# EAGLE design %C2%B5AvaNut_R3 (EAGLE 6.2)
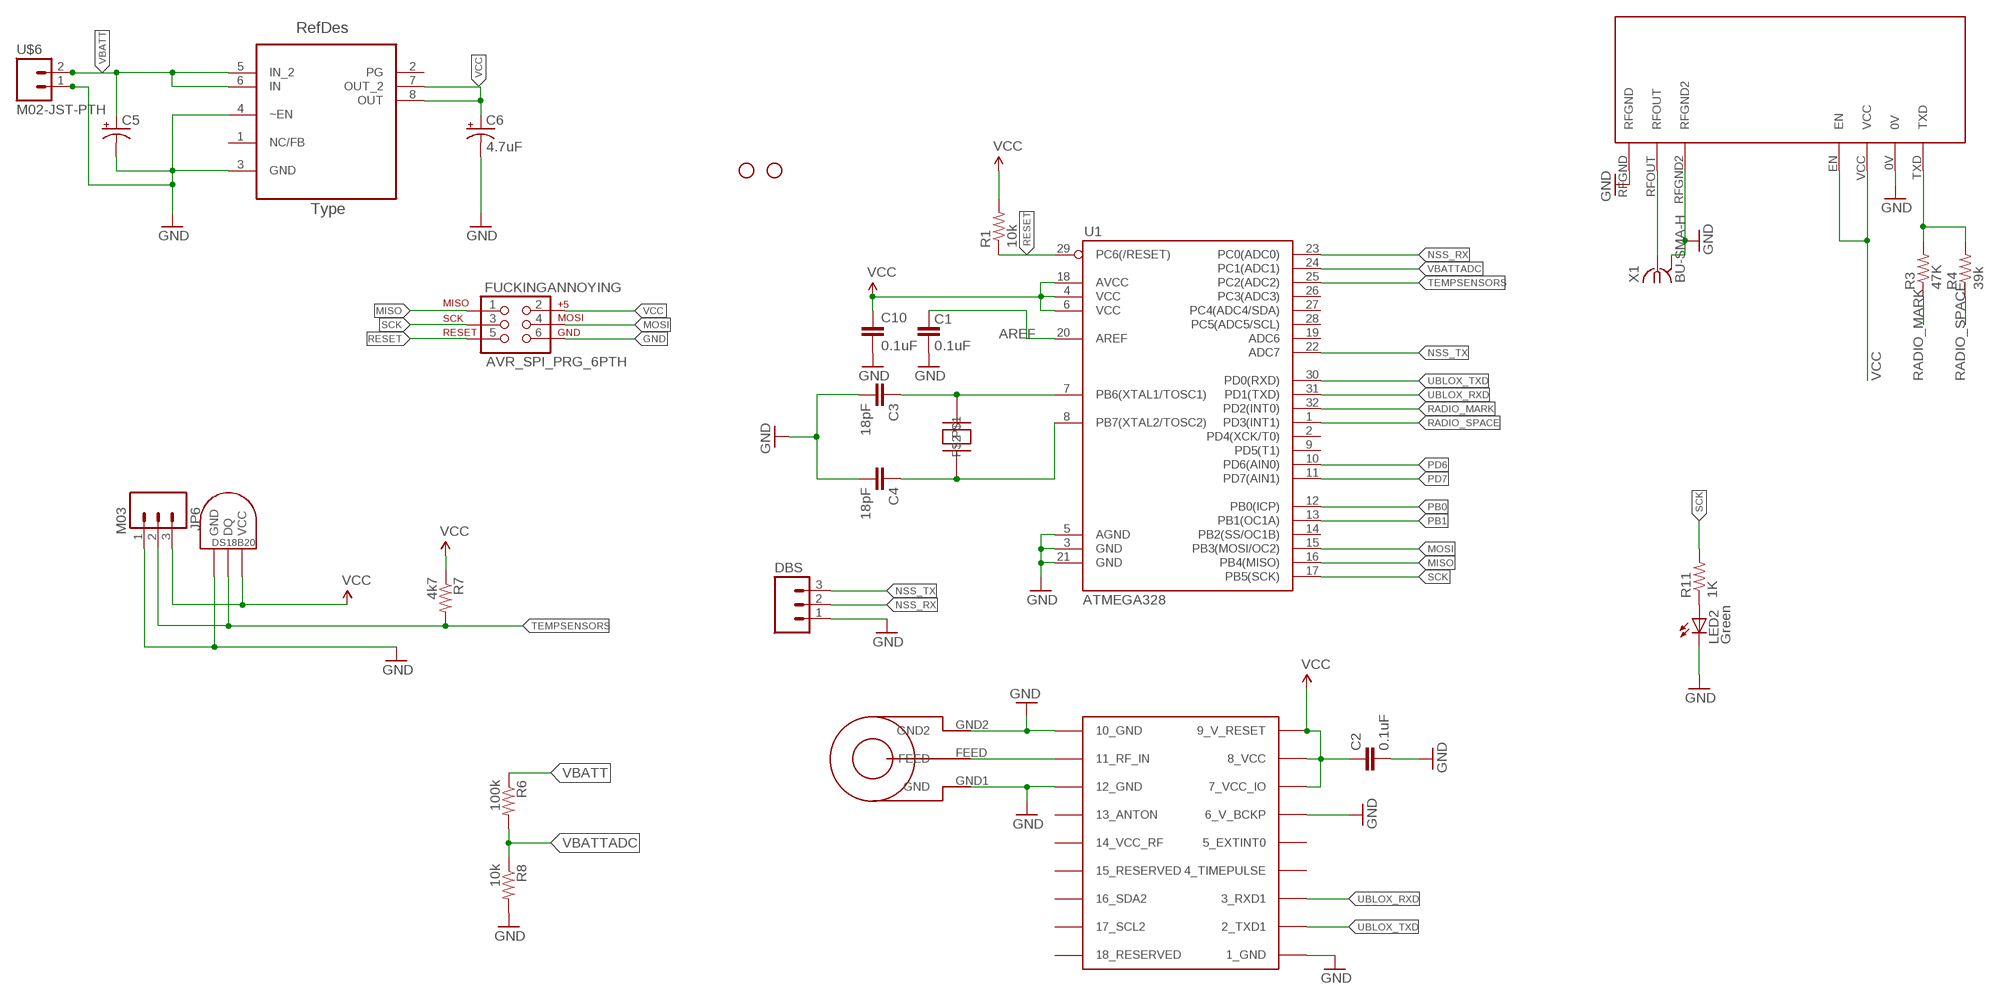
[diagram p0: schematic, sheet 1]

## Parts
C1  0.1uF  CAP0603-CAP  [0603-CAP]
C2  0.1uF  CAP0603-CAP  [0603-CAP]
C3  18pF  CAP0603-CAP  [0603-CAP]
C4  18pF  CAP0603-CAP  [0603-CAP]
C5  CAP_POL1206-KIT  [EIA3216-KIT]
C6  4.7uF  CAP_POL1206-KIT  [EIA3216-KIT]
C10  0.1uF  CAP0603-CAP  [0603-CAP]
DBS  M03PTH  [1X03]
FUCKINGANNOYING  AVR_SPI_PRG_6PTH  [2X3]
JP1  STAND-OFF  [STAND-OFF]
JP2  STAND-OFF  [STAND-OFF]
JP6  M03  [M03-JST]
LED2  Green  LED0603  [LED-0603]
NTX2TEMP  DS1821  DS1820SOIC  [DS18B20_SOIC]
R1  10k  RESISTOR0603-RES  [0603-RES]
R3  47K  RESISTOR0603-RES  [0603-RES]
R4  39k  RESISTOR0603-RES  [0603-RES]
R6  100k  RESISTOR0603-RES  [0603-RES]
R7  4k7  RESISTOR0603-RES  [0603-RES]
R8  10k  RESISTOR0603-RES  [0603-RES]
R11  1K  RESISTOR0603-RES  [0603-RES]
U1  ATMEGA328  ATMEGA168  [TQFP32-08]
U2  TPS76633D  [SOIC127P600X175-8N]
U$1  UBLOX_MAX-6  [UBLOX_MAX-6]
U$2  ABRACON_ABM3_CRYSTAL  [ABRACON_ABM3_CRYSTAL]
U$3  SARANTEL-SR1202  [SARANTEL-SR1202]
U$4  NTX2  [NTX2]
U$6  M02-JST-PTH  [M02-JST-PTH]
X1  BU-SMA-H  [BU-SMA-H]

## Nets
AREF: C1.2 U1.20(AREF)
GND [vcc]: C1.1 C2.2 C3.2 C4.2 C5.C(-) C6.C(-) C10.2 DBS.1 FUCKINGANNOYING.6 JP6.1 LED2.C NTX2TEMP.GND R8.2 U1.3(GND) U1.5(AGND) U1.21(GND) U2.3(GND) U2.4(~EN) U$1.1_GND U$1.6_V_BCKP U$1.10_GND U$1.12_GND U$3.GND1(GND) U$3.GND2 U$4.0V U$4.RFGND U$4.RFGND2 U$6.1 X1.2(GND)
MISO: FUCKINGANNOYING.1 U1.16(PB4(MISO))
MOSI: FUCKINGANNOYING.4 U1.15(PB3(MOSI/OC2))
N$1: U$4.RFOUT X1.1
N$2: R3.2 R4.2 U$4.TXD
N$4: U$1.11_RF_IN U$3.FEED
N$8: LED2.A R11.1
N$9: C3.1 U1.7(PB6(XTAL1/TOSC1)) U$2.P$2
N$10: C4.1 U1.8(PB7(XTAL2/TOSC2)) U$2.P$1
NSS_RX: DBS.2 U1.23(PC0(ADC0))
NSS_TX: DBS.3 U1.22(ADC7)
PB0: U1.12(PB0(ICP))
PB1: U1.13(PB1(OC1A))
PD6: U1.10(PD6(AIN0))
PD7: U1.11(PD7(AIN1))
RADIO_MARK: R3.1 U1.32(PD2(INT0))
RADIO_SPACE: R4.1 U1.1(PD3(INT1))
RESET: FUCKINGANNOYING.5 R1.1 U1.29(PC6(/RESET))
SCK: FUCKINGANNOYING.3 R11.2 U1.17(PB5(SCK))
TEMPSENSORS: JP6.2 NTX2TEMP.DQ R7.2 U1.25(PC2(ADC2))
UBLOX_RXD: U1.31(PD1(TXD)) U$1.3_RXD1
UBLOX_TXD: U1.30(PD0(RXD)) U$1.2_TXD1
VBATT [vcc]: C5.A(+) R6.1 U2.5(IN_2) U2.6(IN) U$6.2
VBATTADC: R6.2 R8.1 U1.24(PC1(ADC1))
VCC: C2.1 C6.A(+) C10.1 FUCKINGANNOYING.2 JP6.3 NTX2TEMP.VCC R1.2 R7.1 U1.4(VCC) U1.6(VCC) U1.18(AVCC) U2.7(OUT_2) U2.8(OUT) U$1.7_VCC_IO U$1.8_VCC U$1.9_V_RESET U$4.EN U$4.VCC
Unconnected: U1.2(PD4(XCK/T0)) U1.9(PD5(T1)) U1.14(PB2(SS/OC1B)) U1.19(ADC6) U1.26(PC3(ADC3)) U1.27(PC4(ADC4/SDA)) U1.28(PC5(ADC5/SCL)) U2.1(NC/FB) U2.2(PG) U$1.4_TIMEPULSE U$1.5_EXTINT0 U$1.13_ANTON U$1.14_VCC_RF U$1.15_RESERVED U$1.16_SDA2 U$1.17_SCL2 U$1.18_RESERVED

## Power pins joined to a net without a drawn wire
GND: X1.3(GND) X1.4(GND) X1.5(GND)

## Library data of the parts
C1-C4 C10 = SparkFun:CAP: Capacitor Standard 0603 ceramic capacitor, and 0.1" leaded capacitor.
C5 C6 = SparkFun:CAP_POL: Capacitor Polarized These are standard SMD and PTH capacitors. Normally 10uF, 47uF, and 100uF in electrolytic and tantalum varieties. Always verify the external diameter of the through hole cap, it varies with capacity, voltage, and manufacturer. The EIA devices should be standard.
DBS = SparkFun:M03: Header 3 Standard 3-pin 0.1" header. Use with straight break away headers (SKU : PRT-00116), right angle break away headers (PRT-00553), swiss pins (PRT-00743), machine pins (PRT-00117), and female headers (PRT-00115). Molex polarized connector foot print use with SKU : PRT-08232 with associated crimp pins and housings.
FUCKINGANNOYING = SparkFun:AVR_SPI_PRG_6: AVR ISP 6 Pin This is the reduced ISP connector for AVR programming. Common on Arduino. This footprint will take up less PCB space and can be used with a 10-pin to 6-pin adapter such as SKU: BOB-08508
JP1 JP2 = SparkFun:STAND-OFF: Stand Off This is the mechanical footprint for a #4 phillips button head screw. Use the keepout ring to avoid running the screw head into surrounding components. SKU : PRT-00447
JP6 = ava:M03
LED2 = SparkFun:LED: LEDs Standard schematic elements and footprints for 5mm, 3mm, 1206, and 0603 sized LEDs. 5mm - Spark Fun Electronics SKU : COM-00529 (and others)
NTX2TEMP = ava:DS1820: DS18B20 Programmable Resolution 1-Wire Digital Thermometer Description The DS18B20 digital thermometer provides 9-bit to 12-bit Celsius temperature measurements and has an alarm function with nonvolatile user-programmable upper and lower trigger points. The DS18B20 communicates over a 1-Wire® bus that by definition requires only one data line (and ground) for communication with a central microprocessor. It has an operating temperature range of -55°C to +125°C and is accurate to ±0.5°C over the range of -10°C to +85°C. In addition, the DS18B20 can derive power directly from the data line ("parasite power"), eliminating the need for an external power supply. Each DS18B20 has a unique 64-bit serial code, which allows multiple DS18B20s to function on the same 1-Wire bus. Thus, it is simple to use one microprocessor to control many DS18B20s distributed over a large area. Applications that can benefit from this feature include HVAC environmental controls, temperature monitoring systems inside buildings, equipment, or machinery, and process monitoring and control systems.
R1 R3 R4 R6-R8 R11 = SparkFun:RESISTOR: Resistor Basic schematic elements and footprints for 0603, 1206, and PTH resistors.
U1 = SparkFun:ATMEGA168
U2 = ava:TPS76633D; DESCRIPTION: ULTRALOW QUIESCENT CURRENT 250-mA LOW DROPOUT VOLTAGE REGULATORS; MPN: TPS76633D; OC_FARNELL: 8461422; OC_NEWARK: 77C1060; PACKAGE: SOIC-8; SUPPLIER: Texas Instruments
U$1 = ava:UBLOX_MAX-6: UBLOX MAX-6
U$2 = ava:ABRACON_ABM3_CRYSTAL
U$3 = ava:SARANTEL-SR1202: SARANTEL-SL1202 Author Anthony Stirk / http://ava.upuaut.net Data Sheet : http://docs-europe.electrocomponents.com/webdocs/0dbd/0900766b80dbde80.pdf
U$4 = ava:NTX2: Radiometrix NTX2 Transmitter Module Author Anthony Stirk / http://ava.upuaut.net
U$6 = ava:M02-JST-PTH
X1 = con-coax:BU-SMA-H: FEMALE SMA CONNECTOR Radiall; OC_FARNELL: unknown; OC_NEWARK: unknown

## Net classes
0 default: width 0.203 mm
1 vcc: width 0.254 mm

## Board
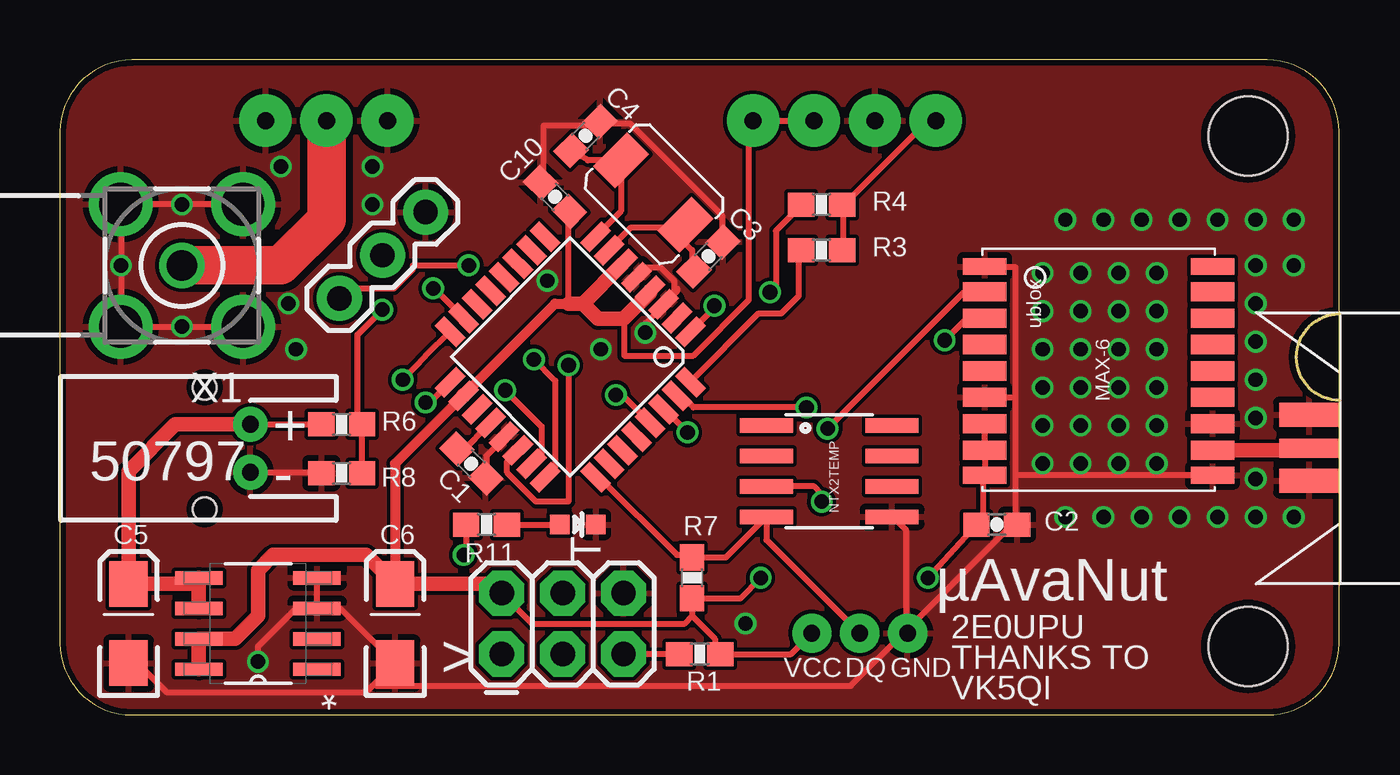
[diagram p1: board, top side]
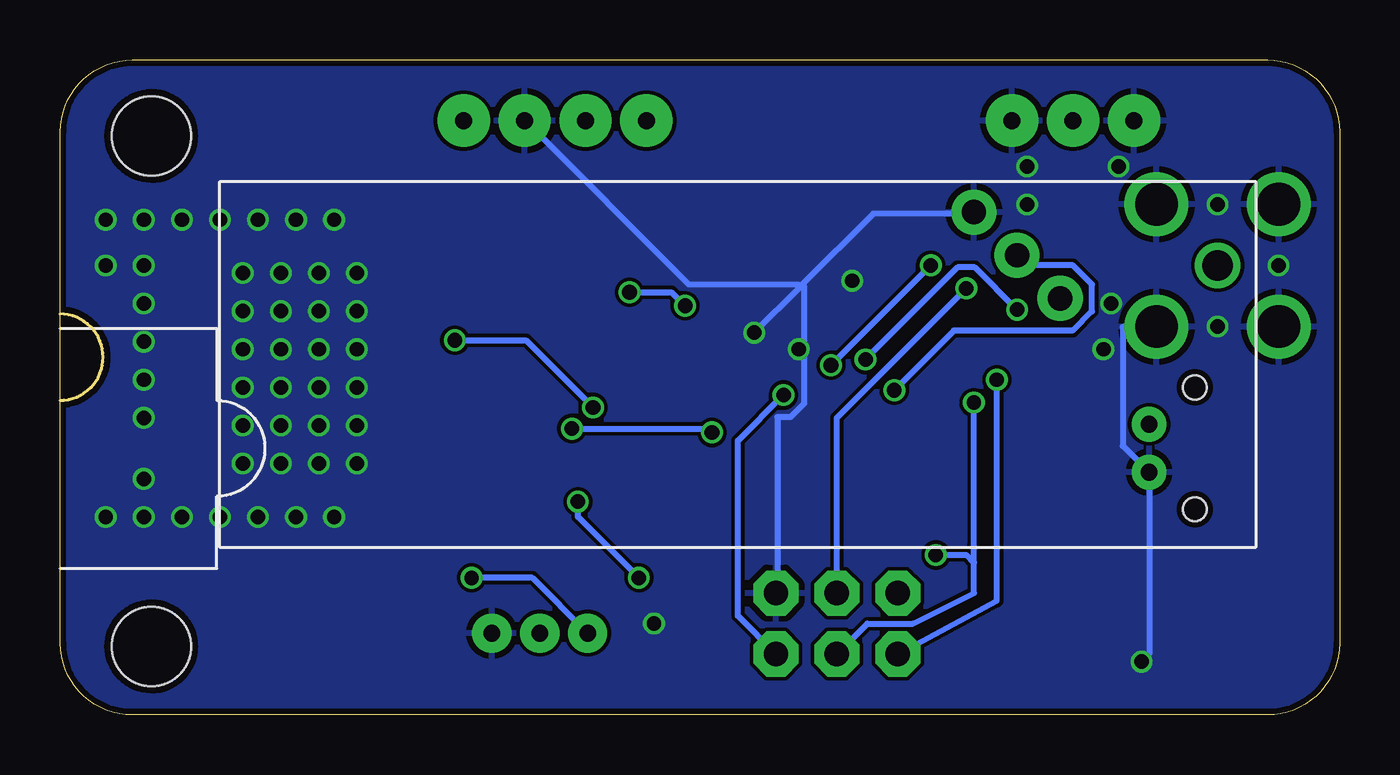
[diagram p2: board, bottom side, seen from below]

Size 53.34 x 27.3 mm. Coordinates in mm from the lower left corner, seen from the top.
Outline: 50.33,27.3 3,27.3 arc90 0,24.3 0,3 arc90 3,0 50.33,0 arc90 53.33,3 53.33,24.3 arc90 50.33,27.3
Copper layers (1*16): Top 0.035mm / dielectric 1.5mm / Bottom 0.035mm
Design rules: minimum track width 6mil, minimum drill 12mil, track to track 6mil, track to pad 6mil, pad to pad 6mil, via to via 6mil, smd to smd 0mil, copper to edge 10mil, drill to drill 10mil, minimum pad ring 10mil, minimum via ring 6mil, stop-mask expansion 2mil, vias tented up to drill 100mil, thermal gap 10mil
tRestrict: 3 lines

### Footprints (pad centres in the part's own frame; a part is rotated, then mirrored left to right if it is on the bottom)
0603-CAP = smd 1.1 x 1: 1 -0.85,0; 2 0.85,0
EIA3216-KIT = smd 1.9 x 1.6: A 1.65,0; C -1.65,0
1X03 = drill 1.016 pad 1.88: 1 0,0; 2 2.54,0; 3 5.08,0
2X3 = drill 1.016 pad 1.88 octagon: 1 0,0; 2 0,2.54; 3 2.54,0; 4 2.54,2.54; 5 5.08,0; 6 5.08,2.54
STAND-OFF = hole 3.302: 0,0
M03-JST = drill 0.7 pad 1.626: 1 -2,0.08; 2 0,0.08; 3 2,0.08
LED-0603 = smd 0.8 x 0.8: A 0,-0.75; C 0,0.75
DS18B20_SOIC = smd 0.61 x 2.21: DQ 1.905,-2.616; GND 1.905,2.616; NC -1.905,-2.616; NC2 -0.635,-2.616; NC3 -1.905,2.616; NC4 -0.635,2.616; NC5 0.635,2.616; VCC 0.635,-2.616
0603-RES = smd 1.1 x 1: 1 -0.85,0; 2 0.85,0
TQFP32-08 = smd 1.27 x 0.559: 1 -4.293,2.8; 2 -4.293,2; 3 -4.293,1.2; 4 -4.293,0.4; 5 -4.293,-0.4; 6 -4.293,-1.2; 7 -4.293,-2; 8 -4.293,-2.8; 17 4.293,-2.8; 18 4.293,-2; 19 4.293,-1.2; 20 4.293,-0.4; 21 4.293,0.4; 22 4.293,1.2; 23 4.293,2; 24 4.293,2.8 | smd 0.559 x 1.27: 9 -2.8,-4.293; 10 -2,-4.293; 11 -1.2,-4.293; 12 -0.4,-4.293; 13 0.4,-4.293; 14 1.2,-4.293; 15 2,-4.293; 16 2.8,-4.293; 25 2.8,4.293; 26 2,4.293; 27 1.2,4.293; 28 0.4,4.293; 29 -0.4,4.293; 30 -1.2,4.293; 31 -2,4.293; 32 -2.8,4.293
SOIC127P600X175-8N = smd 1.981 x 0.559: 1 -2.464,1.905; 2 -2.464,0.635; 3 -2.464,-0.635; 4 -2.464,-1.905; 5 2.464,-1.905; 6 2.464,-0.635; 7 2.464,0.635; 8 2.464,1.905
UBLOX_MAX-6 = smd 1.8 x 0.7: 1_GND 4.95,-4.4; 9_V_RESET 4.95,4.3; 10_GND -4.55,4.3; 18_RESERVED -4.55,-4.4 | smd 1.8 x 0.8: 2_TXD1 4.95,-3.35; 3_RXD1 4.95,-2.25; 4_TIMEPULSE 4.95,-1.15; 5_EXTINT0 4.95,-0.05; 6_V_BCKP 4.95,1.05; 7_VCC_IO 4.95,2.15; 8_VCC 4.95,3.25; 11_RF_IN -4.55,3.25; 12_GND -4.55,2.15; 13_ANTON -4.55,1.05; 14_VCC_RF -4.55,-0.05; 15_RESERVED -4.55,-1.15; 16_SDA2 -4.55,-2.25; 17_SCL2 -4.55,-3.35
ABRACON_ABM3_CRYSTAL = smd 1.3 x 2: P$1 -3.4,0.1; P$2 0.4,0.1
SARANTEL-SR1202 = smd 2.5 x 0.8: FEED 0,0 | smd 2.5 x 1: GND1 0,1.4; GND2 0,-1.35
NTX2 = drill 0.7 pad 2.184: 0V -2.54,-10.16; EN -7.62,-10.16; RFGND -22.86,-10.16; RFGND2 -27.94,-10.16; RFOUT -25.4,-10.16; TXD 0,-10.16; VCC -5.08,-10.16
M02-JST-PTH = drill 0.7 pad 1.448: 1 -1,0; 2 1,0 | hole 1: -2.54,1.905; 2.54,1.905
BU-SMA-H = drill 1.27: 1 0,0 | drill 1.778: 2 -2.55,2.55; 3 2.55,2.55; 4 2.55,-2.55; 5 -2.55,-2.55

### Placement (x,y rotation side)
C1  17.14,10.48 135 top
C2  39.05,7.94 0 top
C3  27.03,19.11 45 top
C4  21.91,24.13 45 top
C5  2.86,3.81 90 top
C6  13.97,3.81 90 top
C10  20.64,21.59 135 top
DBS  15.24,20.95 225 top
FUCKINGANNOYING  18.41,2.54 0 top
JP1  49.53,2.86 0 top
JP2  49.53,24.13 0 top
JP6  33.34,3.49 180 top
LED2  21.59,7.94 270 top
NTX2TEMP  32.07,10.16 270 top
R1  26.67,2.54 0 top
R3  31.75,19.37 0 top
R4  31.75,21.27 0 top
R6  11.75,12.11 0 top
R7  26.35,5.72 90 top
R8  11.75,10.08 180 top
R11  17.78,7.94 180 top
U1  21.27,14.92 225 top
U2  8.26,3.81 180 top
U$1  43.5,14.29 180 top
U$2  25.72,20.64 315 top
U$3  52.07,11.11 0 top
U$4  36.51,14.61 180 bottom
U$6  7.94,11.11 90 top
X1  5.08,18.73 180 top

### Tracks (layer width: path | path; a pad name or v marks a point on that pad's centre or on a via)
AREF
  Top 0.254: C1.2 16.72,10.94 U1.20
GND  (via drill 0.6, 0.61)
  Top 0.254: U1.21 18.52,11.53 17.78,10.8 17.78,10.19 C1.1 17.61,10.02 | U2.3 11.69,4.45 C6.C | U2.3 U2.4 | C5.C 3.24,2.16 4.45,0.95 12.76,0.95 C6.C | v8.26,2.22 8.26,2.86 9.84,4.45 U2.3 | U$6.1 11.05,10.11 R8.2 | JP6.1 35.36,3.45 35.36,3.62 39.68,7.94 C2.2 39.76,8.02 39.84,8.09 39.84,10.02 | 39.84,13.22 38.56,13.22 U$1.6_V_BCKP | 39.84,10.02 39.84,13.22 | 39.84,13.22 39.84,18.66 38.56,18.66 U$1.1_GND | NTX2TEMP.GND 34.72,8.26 35.28,7.7 35.28,3.7 JP6.1 | 39.84,10.02 48,10.02 U$1.10_GND | X1.2 7.6,16.17 2.64,16.17 X1.3 2.56,16.25 2.56,21.22 X1.4 2.64,21.3 7.52,21.3 X1.5 | 25.6,17.53 25.2,17.14 U1.3 25.12,17.06 24.4,16.34 v24.4,15.94 | 25.6,17.53 25.6,18.09 25.04,18.66 24.24,18.66 24.24,18.42 24.08,18.25 U1.5 | C10.2 20.16,22.17 20.16,24.58 22.32,24.58 C4.2 22.4,24.66 23.76,24.66 27.6,20.81 27.6,19.7 27.76,19.53 C3.2 | JP6.1 35.2,3.45 32.96,1.22 13.2,1.22 C6.C | 25.72,17.77 25.72,17.66 25.6,17.53
  Bottom 0.254: v8.26,2.22 7.94,2.54 U$6.1 9.04,11.22 9.04,16.17 7.68,16.17 X1.2 | 22.4,17.94 19.44,20.89 15.28,20.89 DBS.1 | 22.4,17.94 22.48,17.86 | 22.48,17.86 v24.4,15.94 | U$4.0V 33.92,24.73 27.12,17.94 22.56,17.94 22.48,17.86 | FUCKINGANNOYING.6 23.44,5.14 23.44,12.42 22.88,12.42 22.32,12.98 22.32,17.86 22.4,17.94
  other vias: 22.54,15.24 28.57,3.81 49.85,9.84 49.85,12.38 45.72,10.48 40.96,10.48 42.55,10.48 44.13,10.48 45.72,16.83 40.96,16.83 42.55,16.83 44.13,16.83 45.72,15.24 40.96,15.24 42.55,15.24 44.13,15.24 45.72,13.65 40.96,13.65 42.55,13.65 44.13,13.65 45.72,12.06 40.96,12.06 42.55,12.06 44.13,12.06 45.72,18.42 40.96,18.42 42.55,18.42 44.13,18.42 9.21,22.86 13.02,22.86 13.02,21.27 5.08,21.27 2.54,18.73 5.08,16.19 9.53,17.14 9.84,15.24 49.85,8.26 51.44,8.26 48.26,8.26 46.67,8.26 45.09,8.26 43.5,8.26 41.91,8.26 49.85,13.97 49.85,15.56 49.85,17.14 49.85,18.73 51.44,18.73 49.85,20.64 51.44,20.64 48.26,20.64 46.67,20.64 45.09,20.64 43.5,20.64 41.91,20.64 20.32,18.1
  pour Top: -0.32,27.94 53.98,27.94 53.98,-1.27 -0.32,-1.27
  pour Bottom: -0.32,27.94 53.98,27.94 53.98,-1.27 -0.32,-1.27
MISO  (via drill 0.6)
  Top 0.254: v14.29,13.97 15.24,14.96 U1.16
  Bottom 0.254: FUCKINGANNOYING.1 14.29,4.76 v14.29,13.97
MOSI  (via drill 0.6)
  Top 0.254: v15.56,17.78 15.59,17.78 U1.15
  Bottom 0.254: FUCKINGANNOYING.4 20.95,12.38 v15.56,17.78
N$1
  Top 1.6: U$4.RFOUT 11.11,20.64 9.21,18.73 X1.1
N$2
  Top 0.254: U$4.TXD 36.48,24.73 36.16,24.73 32.72,21.3 R4.2 32.64,21.22 32.64,19.41 R3.2
N$4
  Top 0.254: 51.99,11.04 U$3.FEED
  Top 0.61: U$1.11_RF_IN 51.99,11.04
N$8
  Top 0.254: R11.1 LED2.A
N$9
  Top 0.254: U1.7 22.89,19.4 23.81,20.32 25.97,20.32 | 25.97,20.32 U$2.P$2 | 25.97,20.32 25.97,19.75 26.35,19.37 26.35,18.48 C3.1
N$10
  Top 0.254: U1.8 23.38,20.99 U$2.P$1 22.01,23.11 C4.1
NSS_RX  (via drill 0.61)
  Top 0.254: v18.56,13.53 20.08,12.02 20.08,10.9 19.68,10.5 U1.23
  Bottom 0.254: v18.56,13.53 16.08,16.02 11.12,16.02 10.32,16.81 10.32,17.94 11.11,18.73 13.02,18.73 DBS.2 13.44,19.14
NSS_TX  (via drill 0.61)
  Top 0.254: v21.2,14.58 21.2,8.9 19.84,8.9 18.64,10.09 18.64,10.58 19.04,10.98 U1.22 | v17.04,18.73 14.72,18.73 14.72,18.58 13.92,17.78 11.68,17.78 11.68,17.38 DBS.3
  Bottom 0.254: v17.04,18.73 v21.2,14.58
RADIO_MARK
  Top 0.254: U1.32 26.32,13.94 29.12,16.73 30.07,16.73 30.8,17.46 30.8,19.27 R3.1
RADIO_SPACE  (via drill 0.61)
  Top 0.254: v27.28,17.06 27.28,16.98 26.32,16.02 U1.1 | v29.6,17.61 29.84,17.86 29.84,20.17 30.88,21.22 R4.1
  Bottom 0.254: v27.28,17.06 27.84,17.61 v29.6,17.61
RESET  (via drill 0.6)
  Top 0.254: R1.1 FUCKINGANNOYING.5 | v23.18,13.34 23.43,13.34 U1.29
  Bottom 0.254: FUCKINGANNOYING.5 25.08,4.13 25.08,11.43 v23.18,13.34
SCK  (via drill 0.6)
  Top 0.254: v15.24,13.02 15.41,13.02 U1.17 | R11.2 16.93,6.77 v16.83,6.67
  Bottom 0.254: FUCKINGANNOYING.3 19.68,3.81 17.78,3.81 15.24,5.08 15.24,6.35 | 15.24,6.35 v15.24,13.02 | v16.83,6.67 15.56,6.67 15.24,6.35
TEMPSENSORS
  Top 0.254: U1.25 22.48,9.91 25.72,6.67 26.25,6.67 R7.2 27.76,6.57 NTX2TEMP.DQ 29.45,7.3 JP6.2
UBLOX_RXD  (via drill 0.61)
  Top 0.254: v31.12,12.81 26.4,12.81 25.92,13.3 25.76,13.3 U1.31 | v36.88,15.61 37.76,16.5 38.48,16.5 U$1.3_RXD1
  Bottom 0.254: v31.12,12.81 33.92,15.61 v36.88,15.61
UBLOX_TXD  (via drill 0.61)
  Top 0.254: v26.16,11.78 25.2,12.73 U1.30 | v32,11.94 37.68,17.61 38.48,17.61 U$1.2_TXD1
  Bottom 0.254: v26.16,11.78 26.32,11.94 v32,11.94
VBATT
  Top 0.254: U$6.2 11.05,12.11 R6.1
  Top 0.61: U$6.2 4.81,12.11 2.86,10.16 C5.A 5.54,5.46 U2.5 U2.6
VBATTADC  (via drill 0.61)
  Top 0.254: R8.1 R6.2 12.4,12.17 12.4,15.86 v13.44,16.89 | v19.76,14.81 20.64,13.94 20.64,10.34 20.24,9.94 U1.24
  Bottom 0.254: v19.76,14.81 15.92,18.66 15.2,18.66 v13.44,16.89
VCC  (via drill 0.6)
  Top 0.254: U1.6 23.46,19.01 | v36.18,5.72 C2.1 38.48,8.02 38.48,9.94 U$1.9_V_RESET 38.56,10.02 38.56,10.98 U$1.8_VCC 38.56,11.14 38.56,12.09 U$1.7_VCC_IO | 26.35,4.13 R7.1 28.36,4.87 v29.21,5.72 | 26.35,4.13 27.3,3.18 27.3,2.55 R1.2 30.48,2.54 31.34,3.4 JP6.3 | FUCKINGANNOYING.2 19.68,3.81 26.04,3.81 26.35,4.13 | v31.75,8.89 31.75,9.21 31.43,9.52 NTX2TEMP.VCC | U$4.VCC 31.36,24.73 28.96,24.73 U$4.EN 28.88,24.66 28.72,24.5 28.72,17.3 26.4,14.98 23.52,14.98 23.52,16.25 23.5,16.51 | 21.2,17.14 21.2,20.98 21.12,21.06 C10.1
  Top 0.406: 16.79,13.3 13.97,10.48 C6.A | 16.82,13.33 20.64,17.14 21.2,17.14
  Top 0.61: U2.8 U2.7 7.3,3.18 8.26,4.13 8.26,6.03 8.89,6.67 12.76,6.67 C6.A 18.04,5.46 FUCKINGANNOYING.2 | 16.79,13.3 U1.18 16.82,13.33 | 21.2,17.14 21.8,17.14 | 21.8,17.14 U1.6 | U1.4 24.59,17.61 23.5,16.51 22.43,16.51 21.8,17.14
  Bottom 0.254: v36.18,5.72 33.64,5.72 JP6.3 | v29.21,5.72 31.75,8.26 v31.75,8.89

### Text on the board
tPlace: 50797 | + | - | T | µAvaNut | 2E0UPU | THANKS TO | > | VCC | DQ | GND | VK5QI